# EAGLE board reaction_wheel_board_2017_12_11 (EAGLE 8.5.0)
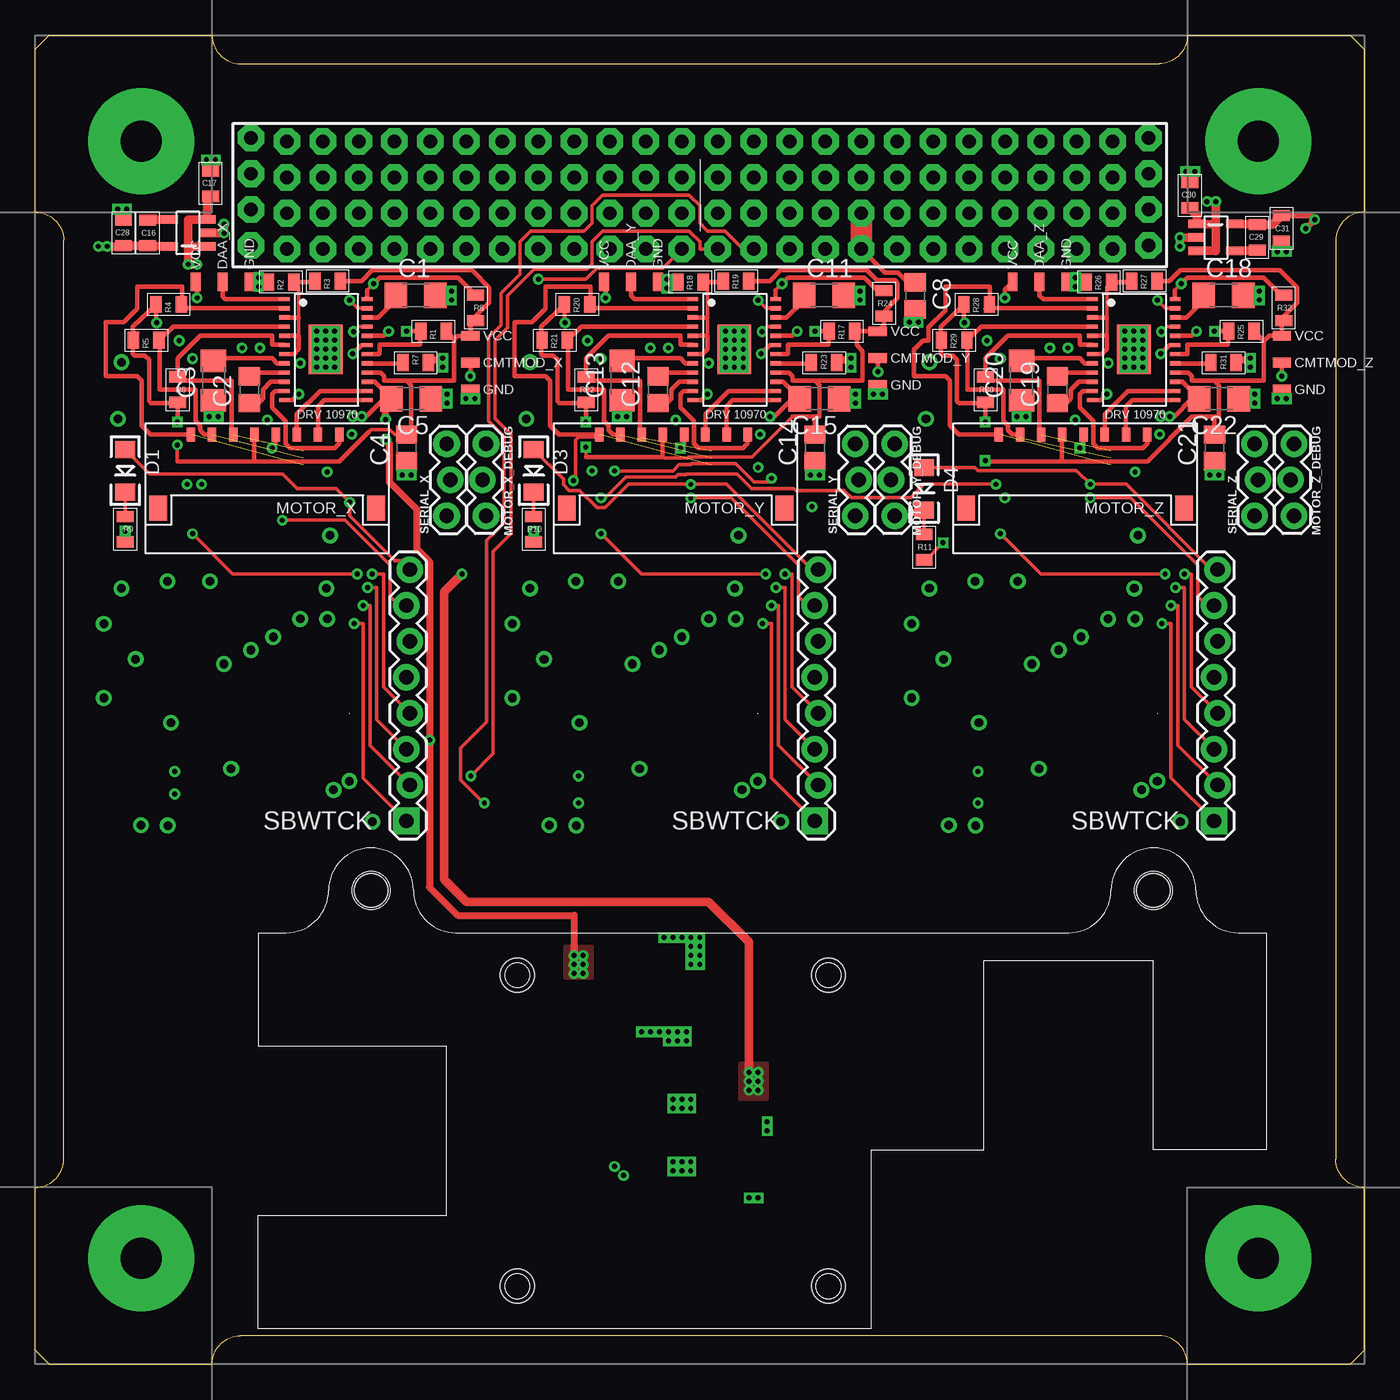
[diagram p2: board, top side]
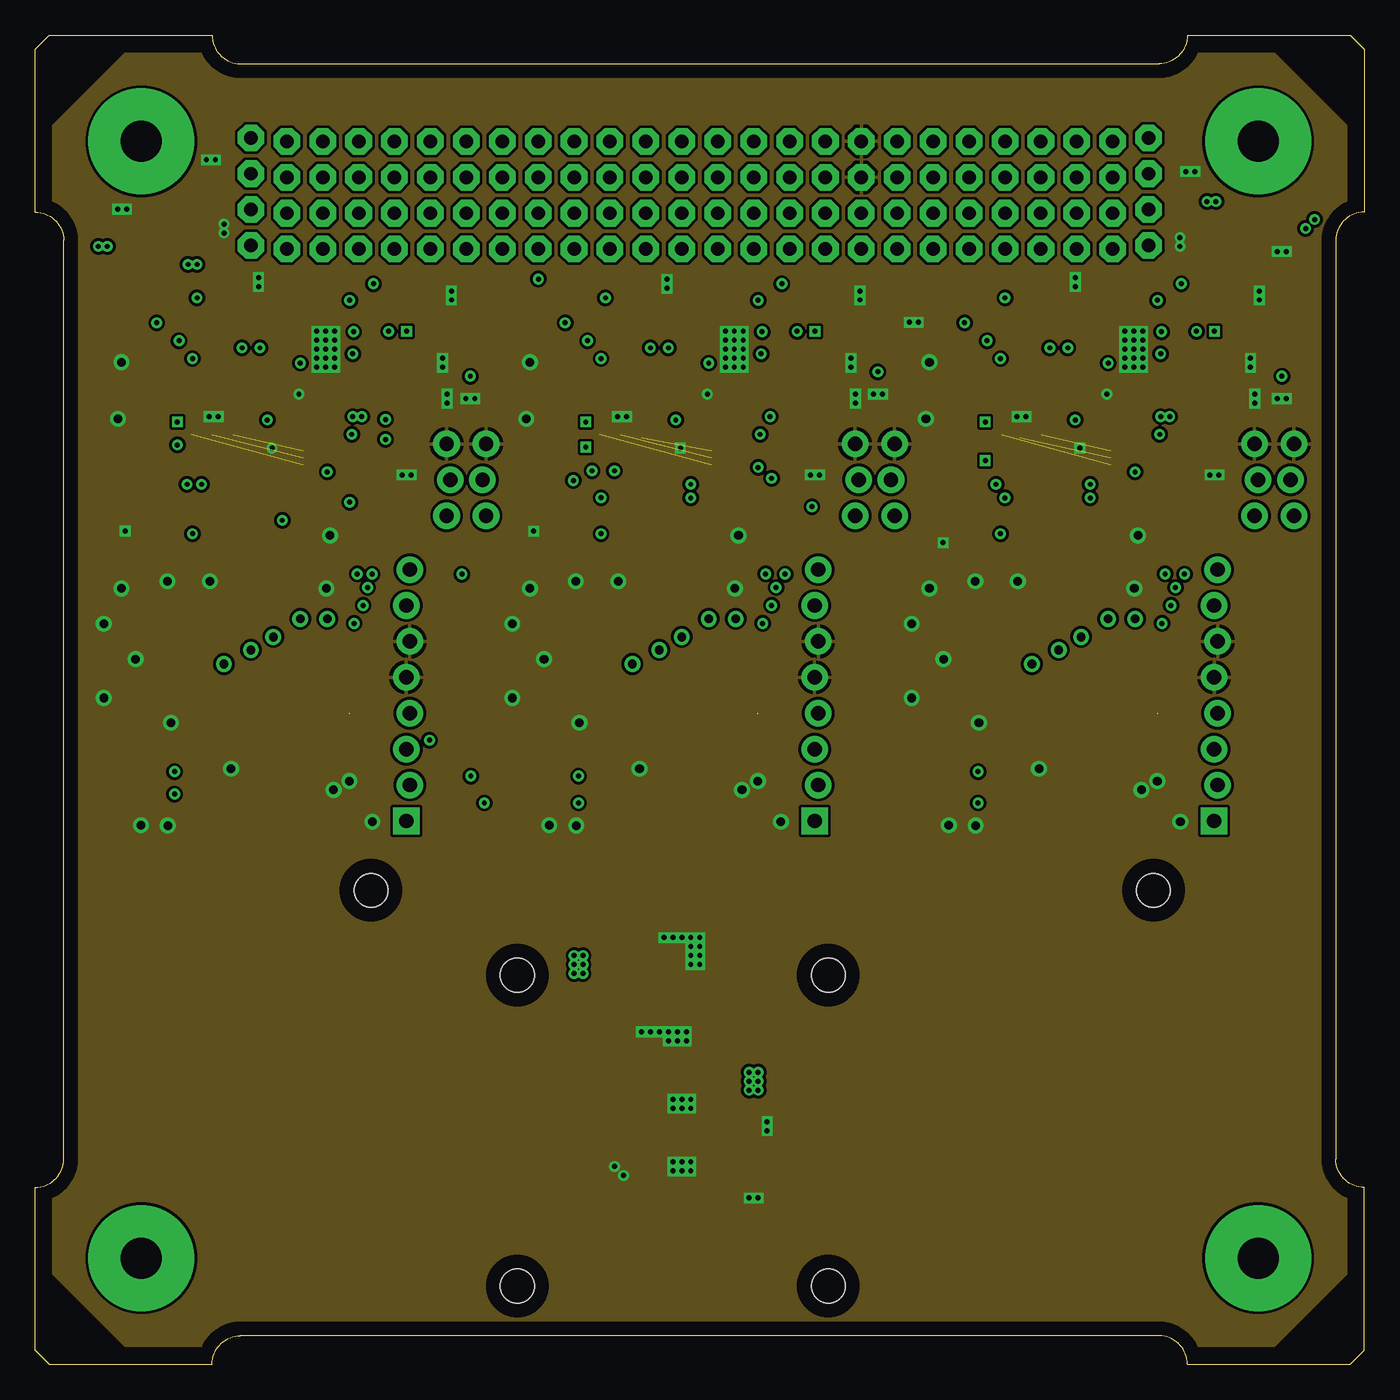
[diagram p3: board, inner layer Ground]
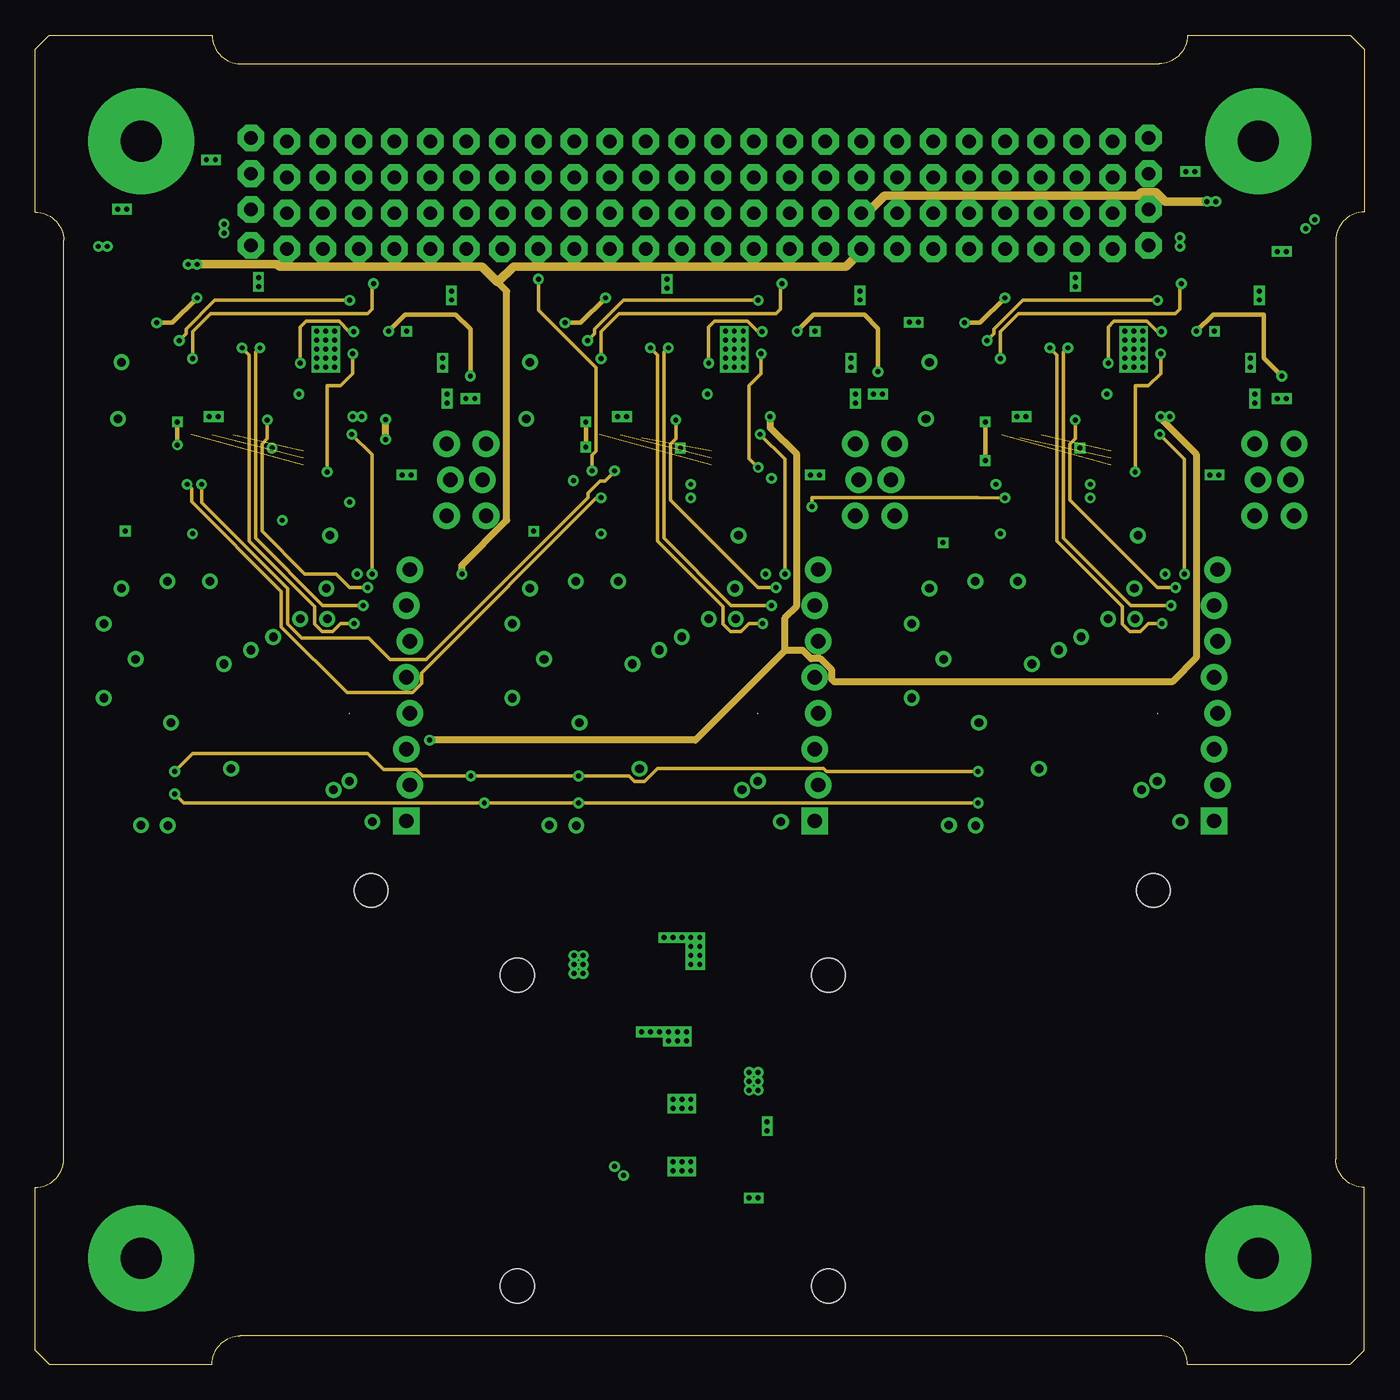
[diagram p4: board, inner layer Signal]
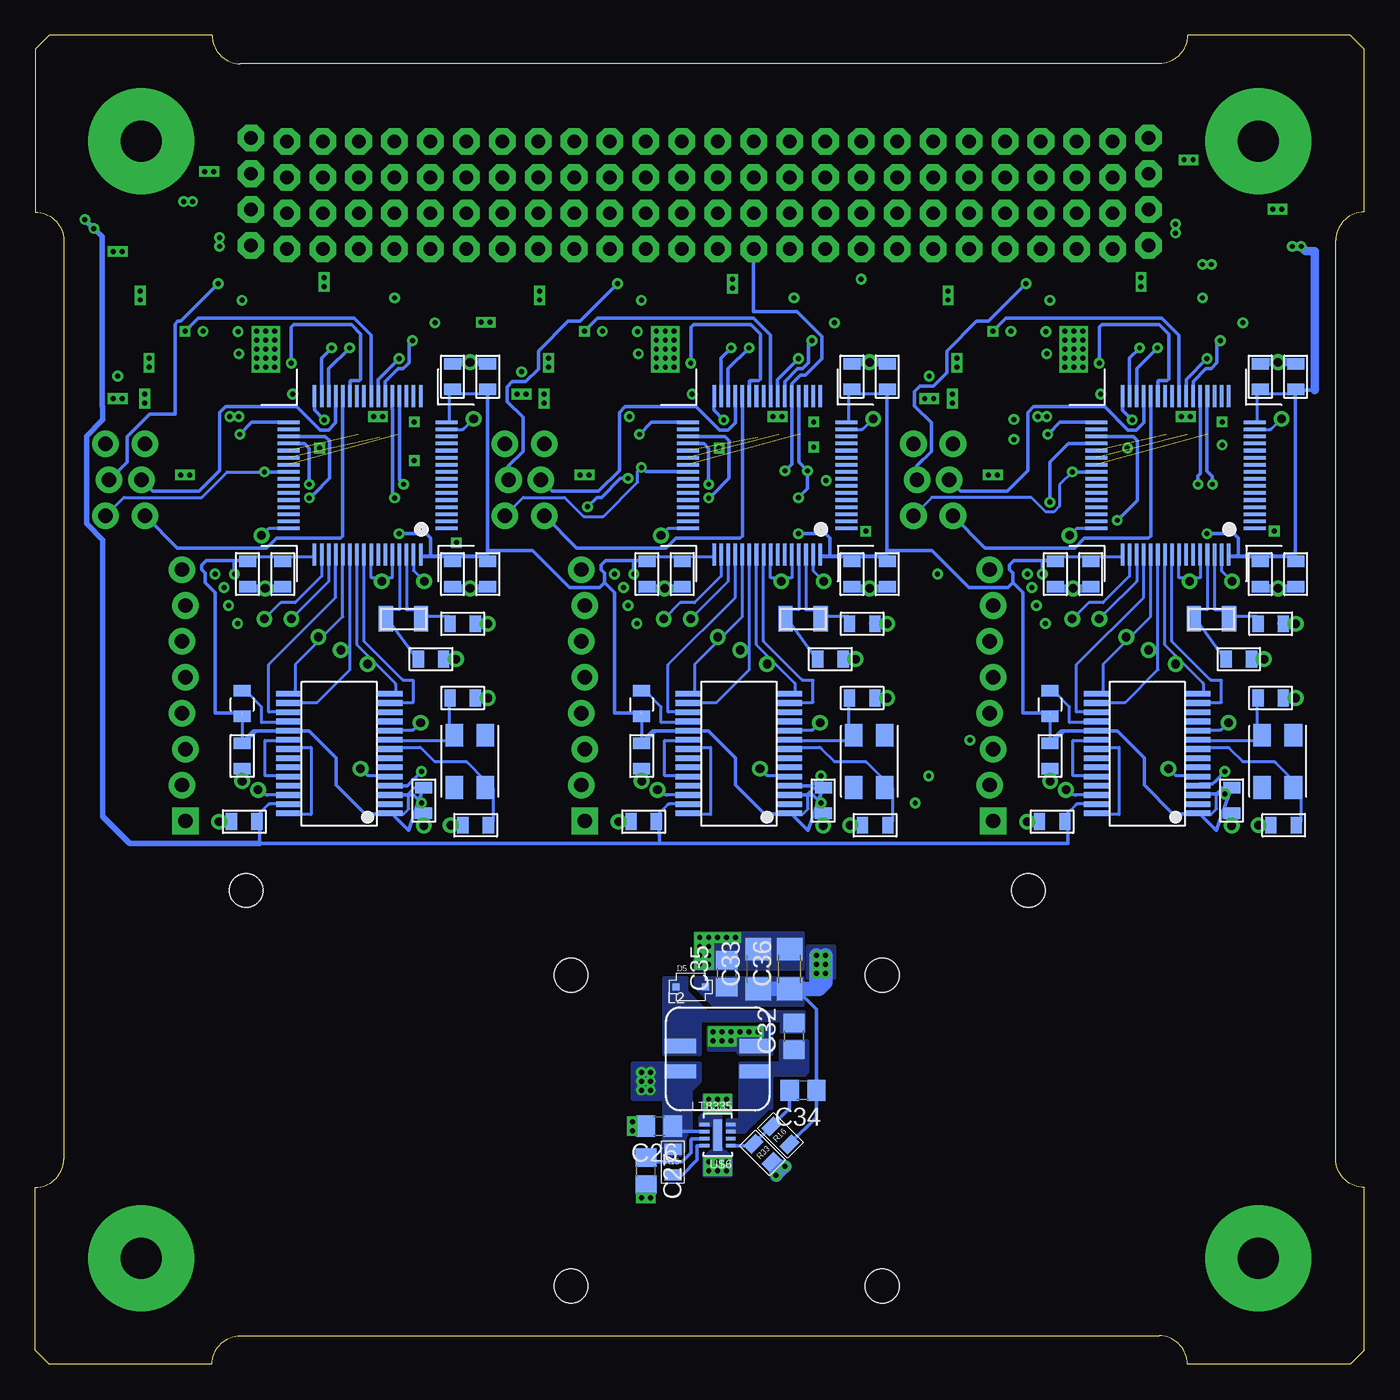
[diagram p5: board, bottom side, seen from below]

Size 94 x 94 mm. Coordinates in mm from the lower left corner, seen from the top.
Copper layers (1*2*3*16): Top 0.035mm / dielectric 1.5mm / Ground 0.035mm / dielectric 0.15mm / Signal 0.035mm / dielectric 0.2mm / Bottom 0.035mm
Design rules "default *": minimum track width 8mil, minimum drill 0.3mm, track to track 8mil, track to pad 8mil, pad to pad 8mil, via to via 8mil, smd to smd 0mil, copper to edge 40mil, drill to drill 8mil, minimum pad ring 10mil, minimum via ring 8mil, stop-mask expansion 4mil, vias tented up to drill 0mil, thermal gap 10mil
Net classes: 0 default: width 0.254 mm, drill 0.254 mm, clearance 0.152 mm

## Footprints (pad centres in the part's own frame; a part is rotated, then mirrored left to right if it is on the bottom)
C1206 = smd 1.6 x 1.8: 1 -1.4,0; 2 1.4,0
C0805 = smd 1.3 x 1.5: 1 -0.95,0; 2 0.95,0
0805 = smd 0.8 x 1.2: 1 -0.9,0; 2 0.9,0
0_OHM_JUMPER = smd 1.3 x 0.7: P$1 0,-1.9; P$2 0,0; P$3 0,1.9
LED-1206 = smd 1.2 x 1.4: A -1.5,0; C 1.5,0
SC-90 = smd 0.5 x 0.5: P$1 -1.05,0; P$2 1.05,0
WURTH_ELEKTRONIK_INDDD_744877001 = smd 1 x 2.2: P$1 -0.9,-2.65; P$2 -0.9,2.65; P$3 0.9,2.65; P$4 0.9,-2.65
PICOLOCK_8 = smd 1.25 x 1.8: MNT@1 -2.605,5.2; MNT@2 12.805,5.2 | smd 0.6 x 1: P$1 0,0; P$2 1.5,0; P$3 3,0; P$4 4.5,0; P$5 6,0; P$6 7.5,0; P$7 9,0; P$8 10.5,0
1X03_LOCK = drill 1.016 pad 1.88: 1 0,0.127; 2 2.54,-0.127; 3 5.08,0.127
1X08_CONNECTOR = drill 1.016 pad 1.88: 2 2.54,-0.127; 3 5.08,0.127; 4 7.62,-0.127; 5 10.16,0.127; 6 12.7,-0.127; 7 15.24,0.127; 8 17.78,-0.127 | drill 1.016 pad 1.88 square: SBWTCK 0,0.127
PC104_CONNECTOR = drill 0.953 pad 1.88 octagon: P$1 -31.75,32.134; P$2 -31.75,34.674; P$3 -31.75,37.214; P$4 -31.75,39.754; P$5 -29.21,31.88; P$6 -29.21,34.42; P$7 -29.21,36.96; P$8 -29.21,39.5; P$9 -26.67,31.88; P$10 -26.67,34.42; P$11 -26.67,36.96; P$12 -26.67,39.5; P$13 -24.13,31.88; P$14 -24.13,34.42; P$15 -24.13,36.96; P$16 -24.13,39.5; P$17 -21.59,31.88; P$18 -21.59,34.42; P$19 -21.59,36.96; P$20 -21.59,39.5; P$21 -19.05,31.88; P$22 -19.05,34.42; P$23 -19.05,36.96; P$24 -19.05,39.5; P$25 -16.51,31.88; P$26 -16.51,34.42; P$27 -16.51,36.96; P$28 -16.51,39.5; P$29 -13.97,31.88; P$30 -13.97,34.42; P$31 -13.97,36.96; P$32 -13.97,39.5; P$33 -11.43,31.88; P$34 -11.43,34.42; P$35 -11.43,36.96; P$36 -11.43,39.5; P$37 -8.89,31.88; P$38 -8.89,34.42; P$39 -8.89,36.96; P$40 -8.89,39.5; P$41 -6.35,31.88; P$42 -6.35,34.42; P$43 -6.35,36.96; P$44 -6.35,39.5; P$45 -3.81,31.88; P$46 -3.81,34.42; P$47 -3.81,36.96; P$48 -3.81,39.5; P$49 -1.27,31.88; P$50 -1.27,34.42; P$51 -1.27,36.96; P$52 -1.27,39.5; P$53 1.27,31.88; P$54 1.27,34.42; P$55 1.27,36.96; P$56 1.27,39.5; P$57 3.81,31.88; P$58 3.81,34.42; P$59 3.81,36.96; P$60 3.81,39.5; P$61 6.35,31.88; P$62 6.35,34.42; P$63 6.35,36.96; P$64 6.35,39.5; P$65 8.89,31.88; P$66 8.89,34.42; P$67 8.89,36.96; P$68 8.89,39.5; P$69 11.43,31.88; P$70 11.43,34.42; P$71 11.43,36.96; P$72 11.43,39.5; P$73 13.97,31.88; P$74 13.97,34.42; P$75 13.97,36.96; P$76 13.97,39.5; P$77 16.51,31.88; P$78 16.51,34.42; P$79 16.51,36.96; P$80 16.51,39.5; P$81 19.05,31.88; P$82 19.05,34.42; P$83 19.05,36.96; P$84 19.05,39.5; P$85 21.59,31.88; P$86 21.59,34.42; P$87 21.59,36.96; P$88 21.59,39.5; P$89 24.13,31.88; P$90 24.13,34.42; P$91 24.13,36.96; P$92 24.13,39.5; P$93 26.67,31.88; P$94 26.67,34.42; P$95 26.67,36.96; P$96 26.67,39.5; P$97 29.21,31.88; P$98 29.21,34.42; P$99 29.21,36.96; P$100 29.21,39.5; P$101 31.75,32.134; P$102 31.75,34.674; P$103 31.75,37.214; P$104 31.75,39.754
SOT-23-5 = smd 0.6 x 1.2: P$1 -0.95,-1.35; P$2 0,-1.35; P$3 0.95,-1.35; P$4 0.95,1.35; P$5 -0.95,1.35
BOARD_TEMPLATE_SECURED = drill 2.9 pad 7.5: P$1 -39.5,39.5; P$2 -39.5,-39.5; P$3 39.5,-39.5; P$4 39.5,39.5
MSP-CAN_BLOCK = smd 1.2 x 0.8: 1 -6,6.08; 2 -6,7.88; 3 -8.5,6.08; 4 -8.5,7.88; 9 -8.5,-6.08; 10 -8.5,-7.88; 11 -6,-6.08; 12 -6,-7.88; 13 8.5,6.08; 14 8.5,7.88; 15 6,6.08; 16 6,7.88; 23 8.875,18.955; 24 8.875,20.755; 25 8.875,17.045; 26 8.875,15.245; 27 -3.975,22.105; 28 -3.975,23.905 | smd 1 x 0.25: 3.3V@CAN1 -3.975,22.025; 3.3V@CAN2 8.875,18.875; 3.3V@MSP1 8.501,5.884; 3.3V@MSP2 -8.533,-5.962; 3.3V_ANALOG@MSP2 -8.482,5.904 | smd 0.8 x 1.2: 5 -5.83,10.5; 6 -7.63,10.5; 7 -3.58,13; 8 -5.38,13; 17 -8.545,24.75; 18 -6.745,24.75; 19 -5.83,15.75; 20 -7.63,15.75; 21 7.83,24.5; 22 9.63,24.5 | smd 0.25 x 1: 5V 7.65,24.5 | smd 1.75 x 0.4: CANH -1.6,21.96; CANL -1.6,22.61; P$65 -1.6,23.91; P$66 -1.6,23.26; P$69 -1.6,21.31; P$70 -1.6,20.66; P$71 -1.6,20.01; P$72 -1.6,19.36; P$73 -1.6,18.71; P$74 -1.6,18.06; P$75 -1.6,17.41; P$76 -1.6,16.76; P$77 -1.6,16.11; P$78 -1.6,15.46; P$79 5.6,15.46; P$80 5.6,16.11; P$81 5.6,16.76; P$82 5.6,17.41; P$83 5.6,18.06; P$84 5.6,18.71; P$85 5.6,19.36; P$86 5.6,20.01; P$87 5.6,20.66; P$88 5.6,21.31; P$89 5.6,21.96; P$90 5.6,22.61; P$91 5.6,23.26; P$92 5.6,23.91 | drill 0.61: GND@1 -3.975,24.775; GND@2 -5.875,24.75; GND@3 -3.75,17.5; GND@4 0.5,20.75; GND@5 -8.5,15.75; GND@7 -8.5,10.5; GND@8 -7.25,8; GND@9 -4,7.5; GND@10 -1,7.5; GND@11 7.75,22.25; GND@12 10.5,24.5; GND@13 8.875,21.625; GND@14 7.25,8; GND@15 7.5,4.25; GND@16 -7.5,-4; GND@17 -7.25,-8; GND@26 -6.25,13; P2.4_SPI-CS2 5.397,10.16; P2.7_SPI-CS3 7.303,10.16; P5.4_SPI-MOSI 3.487,11.434; P5.5_SPI-MISO 1.9,12.354; P5.6_SPI-CLK 0,13.348 | smd 1.55 x 0.25: P1.0_A0 -5.6,3.75; P1.1_A1 -5.6,3.25; P1.2_A2 -5.6,2.75; P1.3_A3 -5.6,-1.75; P1.4_A4 -5.6,-2.25; P1.5_A5 -5.6,-2.75; P1.6_GPIO/PWM 5.6,-0.75; P1.7_GPIO/PWM 5.6,-0.25; P2.1_RXD 5.6,-3.75; P2.2_GPIO/PWM 5.6,-3.25; P3.0_A12 -5.6,2.25; P3.1_A13 -5.6,1.75; P3.2_A14 -5.6,1.25; P3.3_A15 -5.6,0.75; P3.4_GPIO_DEBUG 5.6,-2.75; P3.5_GPIO_DEBUG 5.6,-2.25; P3.6_GPIO/PWM 5.6,-1.75; P3.7_GPIO/PWM 5.6,-1.25; P5.0_I2C-SDA-1 5.6,0.25; P5.1_I2C-SCL-1 5.6,0.75; P7.0_I2C-SDA-2 -5.6,-0.25; P7.1_I2C-SCL-2 -5.6,-0.75; P$8 -5.6,0.25; P$11 -5.6,-1.25; P$15 -5.6,-3.25; P$16 -5.6,-3.75; P$43 5.6,1.25; P$44 5.6,1.75; P$45 5.6,2.25; P$46 5.6,2.75; P$47 5.6,3.25; P$48 5.6,3.75 | smd 0.25 x 1.55: P2.0_TXD 3.75,-5.6; P2.5_GPIO 1.75,-5.6; P2.6_GPIO/PWM 2.25,-5.6; P4.0_GPIO -0.25,-5.6; P4.1_GPIO 0.25,-5.6; P4.2_GPIO 0.75,-5.6; P4.3_GPIO 1.25,-5.6; P7.2_SYNC1 -1.75,-5.6; P7.3_GPIO -1.25,-5.6; P7.4_GPIO -0.75,-5.6; P$17 -3.75,-5.6; P$18 -3.25,-5.6; P$19 -2.75,-5.6; P$49 3.75,5.6; P$50 3.25,5.6; P$51 2.75,5.6; P$52 2.25,5.6; P$53 1.75,5.6; P$54 1.25,5.6; P$55 0.75,5.6; P$56 0.25,5.6; P$57 -0.25,5.6; P$58 -0.75,5.6; P$59 -1.25,5.6; P$60 -1.75,5.6; P$61 -2.25,5.6; P$62 -2.75,5.6; P$63 -3.25,5.6; P$64 -3.75,5.6; PJ.3_SYNC2 -2.25,-5.6; SBWTCK 2.75,-5.6; SBWTDIO 3.25,-5.6 | smd 1 x 1.8: P$93 -3.79,10.16; P$94 -1.29,10.16 | smd 1.25 x 1.6: P$104 -6.13,18.38; P$105 -6.13,22.08; P$106 -8.33,22.08; P$107 -8.33,18.38
DDB = smd 0.61 x 2.2: GND 0,0 | smd 0.7 x 0.25: P$1 -0.925,0.75; P$2 -0.925,0.25; P$3 -0.925,-0.25; P$4 -0.925,-0.75; P$5 0.925,-0.75; P$6 0.925,-0.25; P$7 0.925,0.25; P$8 0.925,0.75
DRV10970 = smd 0.3 x 0.75: BRKMOD -1.6,2.925; CMTMOD -0.95,2.925; CPN 2.3,-2.925; CPP 1.65,-2.925; CS 1,2.925; DAA -3.55,-2.925; FG -3.55,2.925; FR -2.9,2.925; GND@1 3.6,-2.925; PWM -0.3,2.925; RD 0.35,2.925; RETRY -2.25,2.925; U 2.95,2.925; U_HN -2.25,-2.925; U_HP -2.9,-2.925; V 3.6,2.925; V_HN -0.95,-2.925; V_HP -1.6,-2.925; VCP 1,-2.925; VINT 1.65,2.925; VM 2.3,2.925; W 2.95,-2.925; W_HN 0.35,-2.925; W_HP -0.3,-2.925 | smd 3.5 x 2.4: GND@2 0,0
REACTION_WHEEL_BRACKET = hole 2.39: -11,11; 11,11; 11,-11; -11,-11; 21.35,-17; -34,-17

## Placement (x,y rotation side)
C1  2.2uF  [C1206]  26.9,75.6 0 top
C2  0.1uF  [C0805]  15.15,68.93 90 top
C3  1uF  [C1206]  12.61,69.57 90 top
C4  0.1uF  [C0805]  26.26,64.81 90 top
C5  1uF  [C1206]  26.58,68.3 180 top
C8  10 uF  [C0805]  62.24,75.58 270 top
C11  2.2uF  [C1206]  55.79,75.6 0 top
C12  0.1uF  [C0805]  44.04,68.93 90 top
C13  1uF  [C1206]  41.5,69.57 90 top
C14  0.1uF  [C0805]  55.16,64.81 90 top
C15  1uF  [C1206]  55.47,68.3 180 top
C16  0.01 μF  [0805]  7.95,80.02 90 top
C17  1 μF  [0805]  12.39,83.51 270 top
C18  2.2uF  [C1206]  84.05,75.6 0 top
C19  0.1uF  [C0805]  72.3,68.93 90 top
C20  1uF  [C1206]  69.76,69.57 90 top
C21  0.1uF  [C0805]  83.41,64.81 90 top
C22  1uF  [C1206]  83.73,68.3 180 top
C26  2.2 μF  [C0805]  49.86,16.84 180 bottom
C27  2.2 μF  [C0805]  50.81,13.66 270 bottom
C28  1 μF  [0805]  6.23,80.02 270 top
C29  0.01 μF  [0805]  86.43,79.7 270 top
C30  1 μF  [0805]  81.67,82.69 270 top
C31  1μF  [0805]  88.15,80.34 90 top
C32  1 μF  [C0805]  40.33,23.19 90 bottom
C33  22 μF  [C1206]  42.87,27.95 90 bottom
C34  5.6 pF  [C0805]  39.7,19.38 180 bottom
C35  10 μF  [C0805]  45.09,27.63 90 bottom
C36  47 μF  [C1206]  40.65,27.95 90 bottom
CMTMOD_X  0_OHM_JUMPER  [0_OHM_JUMPER]  30.77,70.84 0 top
CMTMOD_Y  0_OHM_JUMPER  [0_OHM_JUMPER]  59.6,71.16 0 top
CMTMOD_Z  0_OHM_JUMPER  [0_OHM_JUMPER]  88.18,70.84 0 top
D1  [LED-1206]  6.36,63.19 270 top
D3  [LED-1206]  35.25,63.19 270 top
D4  [LED-1206]  62.88,61.92 270 top
D5  PMEG6010CEJ  [SC-90]  47.63,26.68 0 bottom
DAA_X  0_OHM_JUMPER  [0_OHM_JUMPER]  13.25,76.55 90 top
DAA_Y  0_OHM_JUMPER  [0_OHM_JUMPER]  42.14,76.55 90 top
DAA_Z  0_OHM_JUMPER  [0_OHM_JUMPER]  71.03,76.55 90 top
L2  WURTH_ELEKTRONIK_INDDD_744877001  [WURTH_ELEKTRONIK_INDDD_744877001]  45.73,21.6 270 bottom
MOTOR_X  PICOLOCK_8  [PICOLOCK_8]  21.5,65.76 180 top
MOTOR_X_DEBUG  [1X03_LOCK]  31.76,65.1 270 top
MOTOR_Y  PICOLOCK_8  [PICOLOCK_8]  50.39,65.76 180 top
MOTOR_Y_DEBUG  [1X03_LOCK]  60.65,65.1 270 top
MOTOR_Z  PICOLOCK_8  [PICOLOCK_8]  78.65,65.76 180 top
MOTOR_Z_DEBUG  [1X03_LOCK]  88.91,65.1 270 top
MSP_X_DEBUG  PROGRAM/DEBUG_PORT  [1X08_CONNECTOR]  26.36,38.43 90 top
MSP_Y_DEBUG  PROGRAM/DEBUG_PORT  [1X08_CONNECTOR]  55.26,38.43 90 top
MSP_Z_DEBUG  PROGRAM/DEBUG_PORT  [1X08_CONNECTOR]  83.51,38.43 90 top
PC104  PC104_CONNECTOR  [PC104_CONNECTOR]  47,47 0 top
R1  3.3K  [0805]  28.17,73.06 0 top
R2  3.3K  [0805]  17.38,76.56 0 top
R3  3.3K  [0805]  20.67,76.63 0 top
R4  10K  [0805]  9.44,74.97 0 top
R5  10K  [0805]  7.85,72.43 0 top
R6  10K  [0805]  10.07,68.93 90 top
R7  [0805]  26.9,70.84 180 top
R8  3.3K  [0805]  31.15,74.72 90 top
R9  [0805]  6.36,59.06 90 top
R10  [0805]  35.25,59.06 90 top
R11  [0805]  62.88,57.8 90 top
R15  1 kΩ  [0805]  48.91,14.3 270 bottom
R16  330 kΩ  [0805]  41.29,16.2 315 bottom
R17  3.3K  [0805]  57.06,73.06 0 top
R18  3.3K  [0805]  46.34,76.56 0 top
R19  3.3K  [0805]  49.57,76.63 0 top
R20  10K  [0805]  38.33,74.97 0 top
R21  10K  [0805]  36.74,72.43 0 top
R22  10K  [0805]  38.96,68.93 90 top
R23  [0805]  55.79,70.84 180 top
R24  3.3K  [0805]  60.04,75.04 90 top
R25  3.3K  [0805]  85.32,73.06 0 top
R26  3.3K  [0805]  75.23,76.56 0 top
R27  3.3K  [0805]  78.46,76.63 0 top
R28  10K  [0805]  66.59,74.97 0 top
R29  10K  [0805]  65,72.43 0 top
R30  10K  [0805]  67.22,68.93 90 top
R31  [0805]  84.05,70.84 180 top
R32  3.3K  [0805]  88.3,74.72 90 top
R33  120 kΩ  [0805]  42.55,14.93 135 bottom
SERIAL_X  [1X03_LOCK]  29.22,60.02 90 top
SERIAL_Y  [1X03_LOCK]  58.11,60.02 90 top
SERIAL_Z  [1X03_LOCK]  86.37,60.02 90 top
U2  TPS732XX  [SOT-23-5]  10.81,80.02 90 top
U3  TPS732XX  [SOT-23-5]  83.51,79.7 270 top
U$1  BOARD_TEMPLATESERCURED  [BOARD_TEMPLATE_SECURED]  47,47 0 top
U$3  MSP-CAN_BLOCK  [MSP-CAN_BLOCK]  13.35,62.88 180 bottom
U$6  LT8335  [DDB]  45.73,16.2 180 bottom
U$7  DRV10970  [DRV10970]  20.55,71.79 270 top
U$9  REACTION_WHEEL_BRACKET  [REACTION_WHEEL_BRACKET]  45.09,16.52 180 top
U$10  MSP-CAN_BLOCK  [MSP-CAN_BLOCK]  42.24,62.88 180 bottom
U$12  DRV10970  [DRV10970]  49.44,71.79 270 top
U$13  MSP-CAN_BLOCK  [MSP-CAN_BLOCK]  70.5,62.88 180 bottom
U$15  DRV10970  [DRV10970]  77.7,71.79 270 top

## Tracks (layer width: path | path; a pad name or v marks a point on that pad's centre or on a via)
+3V3  (via drill 0.35)  (3 unrouted)
  Top 0.254: v11.12,58.75 13.98,55.9 v22.77,55.9 | v40.02,58.75 42.87,55.9 v51.66,55.9 | v68.27,58.75 71.12,55.9 v79.92,55.9
  Top 0.61: U2.P$5 8,79.07 C16.1 C28.2 6.18,79.07 v4.46,79.07
  Bottom 0.254: 3.5,68.91 4.74,68.91 U$3.3.3V@MSP2 4.86,68.79 U$3.3.3V_ANALOG@MSP2 5.05,57.16 8.9,57.16 | U$3.3.3V@CAN1 10.45,37.75 11.44,38.75 11.44,38.81 11.57,38.94 13.54,38.94 15.57,40.97 15.57,42.87 17.47,44.78 21.44,44.78 U$3.3.3V@CAN2 | U$3.3.3V@MSP1 21.99,56.84 22.78,56.84 | 22.78,56.84 24.78,56.84 25.09,56.52 25.09,56.21 24.85,55.96 24.85,55.28 | 24.85,55.28 24.14,54.57 24.14,46.05 22.23,46.05 | 9.54,57.16 8.9,57.16 | 8.9,57.16 8.9,58.43 9.22,58.75 v11.12,58.75 | v22.77,55.9 v22.78,55.9 22.78,56.84 | 33.76,57.56 U$10.3.3V_ANALOG@MSP2 33.94,57.16 37.79,57.16 | 33.63,68.91 U$10.3.3V@MSP2 33.76,68.79 33.76,57.56 | U$10.3.3V@CAN1 39.34,37.75 40.33,38.75 40.33,38.81 40.46,38.94 42.43,38.94 44.46,40.97 44.46,42.87 46.37,44.78 50.34,44.78 U$10.3.3V@CAN2 | U$10.3.3V@MSP1 50.89,56.84 51.67,56.84 | 51.67,56.84 53.67,56.84 53.98,56.52 53.98,56.21 53.74,55.96 53.74,55.28 | 53.74,55.28 53.03,54.57 53.03,46.05 51.13,46.05 | 38.43,57.16 37.79,57.16 | 37.79,57.16 37.79,58.43 38.11,58.75 v40.02,58.75 | v51.66,55.9 v51.67,55.9 51.67,56.84 | 62.01,57.56 U$13.3.3V_ANALOG@MSP2 62.2,57.16 66.05,57.16 | 61.89,68.91 U$13.3.3V@MSP2 62.01,68.79 62.01,57.56 | U$13.3.3V@CAN1 67.59,37.75 68.59,38.75 68.59,38.81 68.72,38.94 70.69,38.94 72.72,40.97 72.72,42.87 74.62,44.78 78.59,44.78 U$13.3.3V@CAN2 | U$13.3.3V@MSP1 79.14,56.84 79.92,56.84 | 79.92,56.84 81.92,56.84 82.24,56.52 82.24,56.21 82,55.96 82,55.28 81.29,54.57 81.29,46.05 79.39,46.05 | 66.69,57.16 66.05,57.16 | 66.05,57.16 66.05,58.43 66.37,58.75 v68.27,58.75 | v79.92,55.9 79.92,56.84 | 24.85,55.28 25.19,54.94 27.95,54.94 30.57,57.56 33.76,57.56
  Bottom 0.254: 53.74,55.28 54.08,54.94 56.21,54.94 58.83,57.56 62.01,57.56
  Bottom 0.61: 3.5,68.91 3.5,78.75 4.14,78.75 v4.46,79.07 v5.09,79.07
+5V  (via drill 0.35)
  Top 0.406: C31.2 90.23,81.24 v90.5,80.97 v89.86,80.34
  Top 0.61: U3.P$5 86.38,80.65 C29.1 87.51,80.6 C31.2
  Bottom 0.254: U$3.5V 20.96,38.34 20.96,36.84 49.86,36.84 | 49.86,36.84 49.86,37.45 49.89,37.48 U$10.5V | 49.86,36.84 78.11,36.84 78.11,37.45 78.14,37.48 U$13.5V
  Bottom 0.406: 78.11,36.84 87.32,36.84 89.23,38.75 89.23,58.3 90.38,59.46 90.38,65.66 89.23,66.81 89.23,67.7 89.28,67.75 89.28,79.75 v90.5,80.97
BRKMOD_X  (via drill 0.35)
  Top 0.254: U$7.BRKMOD 22.87,73.39 v22.52,73.03
  Signal 0.254: v22.52,73.03 22.21,73.03 21.48,73.77 19.16,73.77 18.74,73.35 v18.74,70.81
  Bottom 0.254: U$3.P4.3_GPIO 14.6,69.54 14.56,69.58 13.94,69.58 13.83,69.7 13.83,72.87 14.49,73.53 18.57,73.53 18.74,73.35 v18.74,70.81
BRKMOD_Y  (via drill 0.35)
  Top 0.254: U$12.BRKMOD 51.77,73.39 v51.41,73.03
  Signal 0.254: v51.41,73.03 51.11,73.03 50.37,73.77 48.05,73.77 47.63,73.35 v47.63,70.81
  Bottom 0.254: U$10.P4.3_GPIO 43.49,69.54 43.45,69.58 42.84,69.58 42.72,69.7 42.72,72.87 43.38,73.53 47.46,73.53 47.63,73.35 v47.63,70.81
BRKMOD_Z  (via drill 0.35)
  Top 0.254: U$15.BRKMOD 80.02,73.39 v79.67,73.03
  Signal 0.254: v79.67,73.03 79.36,73.03 78.63,73.77 76.31,73.77 75.89,73.35 v75.89,70.81
  Bottom 0.254: U$13.P4.3_GPIO 71.75,69.54 71.71,69.58 71.09,69.58 70.98,69.7 70.98,72.87 71.64,73.53 75.72,73.53 75.89,73.35 v75.89,70.81
CANH  (via drill 0.35)
  Top 0.254: PC104.P$53 47,78.88 47,79.41 46.26,80.15 40.12,80.15 39.38,79.41 39.38,77.81 39.03,77.46 35.29,77.46 33.4,75.57 33.4,73.32 32.53,72.45 32.53,66.89 33.66,65.76 33.66,58.75 32.39,57.48 32.39,43.19 v30.81,41.6
  Signal 0.254: v9.85,41.92 11.12,43.19 23.51,43.19 24.64,42.06 26.94,42.06 27.4,41.6 v30.81,41.6 v38.43,41.6 42,41.6 42.37,41.24 43.11,41.24 44.01,42.14 55.76,42.14 55.97,41.92 v66.69,41.92
  Bottom 0.254: U$3.CANH 11.63,41.04 10.73,41.04 10.54,41.23 v9.85,41.92 | v38.43,41.6 39.12,40.91 U$10.CANH | v66.69,41.92 67.69,40.91 U$13.CANH
CANL  (via drill 0.35)
  Top 0.254: PC104.P$57 50.07,78.88 48.8,80.15 47.55,80.15 47,80.7 47,81.95 46.26,82.69 40.12,82.69 39.38,81.95 39.38,80.7 38.83,80.15 35.04,80.15 34.3,79.41 34.3,77.12 32.94,75.76 32.94,73.51 32.08,72.64 32.08,66.7 33.16,65.62 33.16,59.49 31.94,58.27 31.94,45.41 30.1,43.57 30.1,41.31 31.71,39.7 v31.76,39.7
  Signal 0.254: v9.85,40.33 10.49,39.7 v31.76,39.7 v38.43,39.7 v66.69,39.7
  Bottom 0.254: U$3.CANL 11.68,40.33 v9.85,40.33 | v38.43,39.7 39,40.27 U$10.CANL | v66.69,39.7 67.25,40.27 U$13.CANL
CMTMOD_X  (via drill 0.35)
  Top 0.305: U$7.CMTMOD 24.67,72.74 v24.99,73.06 | v30.77,69.89 CMTMOD_X.P$2
  Signal 0.305: v24.99,73.06 26.16,74.23 29.74,74.23 30.77,73.2 v30.77,69.89
CMTMOD_Y  (via drill 0.35)
  Top 0.305: U$12.CMTMOD 53.57,72.74 v53.89,73.06 | v59.6,70.2 CMTMOD_Y.P$2
  Signal 0.305: v53.89,73.06 55.06,74.23 58.63,74.23 59.6,73.27 v59.6,70.2
CMTMOD_Z  (via drill 0.35)
  Top 0.305: U$15.CMTMOD 81.82,72.74 v82.14,73.06 | v88.18,69.89 CMTMOD_Z.P$2
  Signal 0.305: v82.14,73.06 83.31,74.23 86.89,74.23 86.89,71.17 v88.18,69.89
CPN_X
  Top 0.305: U$7.CPN 16.66,69.49 16.1,68.94 16.1,68.3 15.79,67.98 C2.1
CPN_Y
  Top 0.305: U$12.CPN 45.55,69.49 45,68.94 45,68.3 44.68,67.98 C12.1
CPN_Z
  Top 0.305: U$15.CPN 73.81,69.49 73.25,68.94 73.25,68.3 72.94,67.98 C19.1
CPP_X
  Top 0.305: U$7.CPP 15.09,70.14 C2.2
CPP_Y
  Top 0.305: U$12.CPP 43.98,70.14 C12.2
CPP_Z
  Top 0.305: U$15.CPP 72.24,70.14 C19.2
CS_X
  Top 0.305: U$7.CS 25.58,70.79 R7.2
CS_Y
  Top 0.305: U$12.CS 54.48,70.79 R23.2
CS_Z
  Top 0.305: U$15.CS 82.73,70.79 R31.2
DAA_X
  Top 0.305: 13.35,76.45 DAA_X.P$2 13.25,75.53 13.43,75.34 U$7.DAA
DAA_Y
  Top 0.305: U$12.DAA 42.4,75.34 42.14,75.6 DAA_Y.P$2
DAA_Z
  Top 0.305: U$15.DAA 71.29,75.34 71.03,75.6 DAA_Z.P$2
EN_UVLO
  Bottom 0.254: U$6.P$8 47.18,15.45 47.18,14.44 48.22,13.4 R15.2
FBX
  Bottom 0.254: U$6.P$1 43.31,15.45 R33.2 R16.1 40.65,18.11 C34.2
FG_X  (via drill 0.35)
  Top 0.254: 23.47,75.99 v23.92,76.43
  Top 0.305: U$7.FG 23.47,75.99 | v23.92,76.43 24.36,76.87 29.9,76.87 R8.2
  Signal 0.254: v23.92,76.43 23.82,76.34 23.82,74.62 23.51,74.31 12.39,74.31 11.12,73.03 v11.12,71.13
  Bottom 0.254: v11.12,71.13 12.6,69.66 U$3.P7.4_GPIO | v23.92,76.43 26.58,73.77 27.41,73.77 29.51,71.67 29.51,70.14 30.48,69.18 31.43,69.18 31.8,68.81 31.8,67.78 30.62,66.6 30.62,64.57 31.63,63.55 MOTOR_X_DEBUG.2
FG_Y  (via drill 0.35)
  Top 0.254: 52.37,75.99 v52.81,76.43
  Top 0.305: U$12.FG 52.37,75.99 | v52.81,76.43 53.25,76.87 53.89,76.87 53.9,76.86 58.65,76.86 59.57,75.94 R24.2
  Signal 0.254: v52.81,76.43 52.72,76.34 52.72,74.62 52.4,74.31 41.29,74.31 40.02,73.03 v40.02,71.13
  Bottom 0.254: v40.02,71.13 41.49,69.66 U$10.P7.4_GPIO | v52.81,76.43 55.47,73.77 56.31,73.77 58.4,71.67 58.4,70.4 59.31,69.5 60.26,69.5 60.63,69.13 60.63,68.1 59.51,66.98 59.51,64.57 60.52,63.55 MOTOR_Y_DEBUG.2
FG_Z  (via drill 0.35)
  Top 0.254: 80.62,75.99 v81.07,76.43
  Top 0.305: U$15.FG 80.62,75.99 | v81.07,76.43 81.51,76.87 82.15,76.87 82.16,76.86 86.91,76.86 88.14,75.62 R32.2
  Signal 0.254: v81.07,76.43 80.97,76.34 80.97,74.62 80.66,74.31 69.54,74.31 68.27,73.03 v68.27,71.13
  Bottom 0.254: v68.27,71.13 69.75,69.66 U$13.P7.4_GPIO | MOTOR_Z_DEBUG.2 87.51,63.83 87.51,65.62 85.92,67.22 84.12,67.22 84.12,73.58 83.93,73.77 83.73,73.77 v81.07,76.43
FR_X  (via drill 0.35)
  Top 0.254: U$7.FR 22.8,74.69 v22.23,75.26
  Signal 0.254: v10.17,72.4 10.67,72.89 10.67,73.22 12.7,75.26 v22.23,75.26
  Bottom 0.254: U$3.P7.3_GPIO 12.1,69.51 11.18,70.42 10.83,70.42 10.41,70.84 10.41,72.16 v10.17,72.4
FR_Y  (via drill 0.35)
  Top 0.254: U$12.FR 51.69,74.69 v51.13,75.26
  Signal 0.254: v39.06,72.4 39.56,72.89 39.56,73.22 41.59,75.26 v51.13,75.26
  Bottom 0.254: U$10.P7.3_GPIO 40.99,69.51 40.08,70.42 39.72,70.42 39.31,70.84 39.31,72.16 v39.06,72.4
FR_Z  (via drill 0.35)
  Top 0.254: U$15.FR 79.95,74.69 v79.39,75.26
  Signal 0.254: v67.32,72.4 67.81,72.89 67.81,73.22 69.85,75.26 v79.39,75.26
  Bottom 0.254: U$13.P7.3_GPIO 69.25,69.51 68.33,70.42 67.98,70.42 67.56,70.84 67.56,72.16 v67.32,72.4
GND  (via drill 0.35)
  Top 0.254: v30.45,68.3 30.45,68.62 CMTMOD_X.P$1 31.09,68.62 v31.09,68.3 | v25.95,62.9 25.95,63.54 C4.1 | C4.1 | v26.58,62.9 26.58,63.54 C4.1 | v12.29,67.03 12.29,67.85 C3.1 12.93,67.85 v12.93,67.03 | v15.79,76.24 15.46,76.24 DAA_X.P$1 15.46,76.87 v15.79,76.87 | v29.44,75.92 28.62,75.92 C1.2 28.62,75.28 v29.44,75.28 | v28.8,71.16 28.17,71.16 R7.1 arc-90 v28.8,70.52 | v29.12,68.62 28.3,68.62 28.07,68.39 | 28.07,68.39 C5.1 | v29.12,67.98 28.49,67.98 28.07,68.39 | v20.55,71.16 v21.18,70.52 | v20.55,71.16 v20.55,70.52 U$7.GND@2 | v20.55,71.16 v19.91,70.52 | U$7.GND@2 v19.91,71.16 | U$7.GND@2 v20.55,71.16 | U$7.GND@2 v21.18,71.16 | U$7.GND@2 v21.18,71.79 | U$7.GND@2 v19.91,71.79 | U$7.GND@2 v19.91,72.43 | U$7.GND@2 v21.18,72.43 | v20.55,72.43 v21.18,73.06 | U$7.GND@2 v20.55,73.06 | U$7.GND@2 v20.55,72.43 | v20.55,72.43 v19.91,73.06 | v59.28,68.62 59.28,68.94 CMTMOD_Y.P$1 59.92,68.94 v59.92,68.62 | v54.84,62.9 54.84,63.54 C14.1 | C14.1 | v55.47,62.9 55.47,63.54 C14.1 | v41.19,67.03 41.19,67.85 C13.1 41.82,67.85 v41.82,67.03 | v44.68,76.11 44.36,76.24 DAA_Y.P$1 44.36,76.87 v44.68,76.75 | v58.33,75.92 57.51,75.92 C11.2 57.51,75.28 v58.33,75.28 | v57.7,71.16 57.06,71.16 R23.1 arc-90 v57.7,70.52 | v58.01,68.62 57.19,68.62 56.97,68.39 | 56.97,68.39 C15.1 | v58.01,67.98 57.38,67.98 56.97,68.39 | v49.44,71.16 v50.08,70.52 | v49.44,71.16 v49.44,70.52 U$12.GND@2 | v49.44,71.16 v48.81,70.52 | U$12.GND@2 v48.81,71.16 | U$12.GND@2 v49.44,71.16 | U$12.GND@2 v50.08,71.16 | U$12.GND@2 v50.08,71.79 | U$12.GND@2 v48.81,71.79 | U$12.GND@2 v48.81,72.43 | U$12.GND@2 v50.08,72.43 | v49.44,72.43 v50.08,73.06 | U$12.GND@2 v49.44,73.06 | U$12.GND@2 v49.44,72.43
  Top 0.254: v49.44,72.43 v48.81,73.06 | v87.86,68.3 87.86,68.62 CMTMOD_Z.P$1 88.49,68.62 v88.49,68.3 | v83.1,62.9 83.1,63.54 C21.1 | C21.1 | v83.73,62.9 83.73,63.54 C21.1 | v69.44,67.03 69.44,67.85 C20.1 70.08,67.85 v70.08,67.03 | v73.57,76.24 73.35,76.24 73.25,76.24 DAA_Z.P$1 73.25,76.87 v73.57,76.87 | v86.59,75.92 85.77,75.92 C18.2 85.77,75.28 v86.59,75.28 | v85.95,71.16 85.32,71.16 R31.1 arc-90 v85.95,70.52 | v86.27,68.62 85.45,68.62 85.22,68.39 | 85.22,68.39 C22.1 | v86.27,67.98 85.64,67.98 85.22,68.39 | v77.7,71.16 v78.33,70.52 | v77.7,71.16 v77.7,70.52 U$15.GND@2 | v77.7,71.16 v77.06,70.52 | U$15.GND@2 v77.06,71.16 | U$15.GND@2 v77.7,71.16 | U$15.GND@2 v78.33,71.16 | U$15.GND@2 v78.33,71.79 | U$15.GND@2 v77.06,71.79 | U$15.GND@2 v77.06,72.43 | U$15.GND@2 v78.33,72.43 | v77.7,72.43 v78.33,73.06 | U$15.GND@2 v77.7,73.06 | U$15.GND@2 v77.7,72.43 | v77.7,72.43 v77.06,73.06 | v6.36,58.94 R9.1 | R10.1 v35.25,58.92 | R11.1 63,56.9 v64.21,58.11
  Top 0.305: v16.74,64.81 17,65.07 MOTOR_X.P$4 | U$7.GND@1 18.22,68.19 v18.64,68.62 | v45.63,64.81 45.89,65.07 MOTOR_Y.P$4 | U$12.GND@1 47.11,68.19 v47.54,68.62 | v73.89,64.81 74.15,65.07 MOTOR_Z.P$4 | U$15.GND@1 75.37,68.19 v75.79,68.62 | v15.79,76.87 16.16,76.87 R2.1 16.16,76.24 v15.79,76.24 | v44.68,76.75 45,76.56 R18.1 45.12,76.24 v44.68,76.11 | v73.57,76.87 73.89,76.56 R26.1 74.01,76.24 73.35,76.24 | v62.46,73.7 62.46,74.41 C8.2 62.24,74.11 v61.82,73.7
  Top 0.61: U2.P$2 v13.35,80.02 v13.35,80.66 | v5.82,81.7 6.23,81.28 C28.1 6.45,81.14 v6.45,81.7 | v12.1,85.19 12.1,84.7 C17.1 12.39,84.84 v12.74,85.19 | U3.P$2 v80.97,79.7 v80.97,79.07 | v87.86,78.71 88.15,79 C31.1 88.15,79.06 v88.49,78.71 | v81.38,84.36 81.38,83.93 C30.1 81.67,84.02 v82.02,84.36
  Bottom 0.254: v51.76,16.52 51.45,16.84 C26.2 51.12,17.16 v51.76,17.16 | v51.13,11.76 50.81,12.08 C27.2 | C27.2 | v50.49,11.76 50.49,12.39 C27.2
  Bottom 0.762: 41.6,13.98 R33.1
  Bottom 0.914: v41.6,13.35 41.6,13.98 v40.97,13.98 v41.6,13.35
  other vias: 20.55,71.79 49.44,71.79 77.7,71.79 47,30.17 47,29.54 47,28.9 47,28.27 46.37,28.27 46.37,28.9 46.37,29.54 46.37,30.17 45.73,30.17 45.09,30.17 44.46,30.17 44.78,22.87 45.41,22.87 46.05,22.87 46.05,23.51 45.41,23.51 44.78,23.51 44.14,23.51 43.51,23.51 42.87,23.51 45.73,18.11 46.37,18.11 45.09,18.11 45.09,18.74 45.73,18.74 46.37,18.74 45.73,14.3 45.09,14.3 46.37,14.3 46.37,13.66 45.73,13.66 45.09,13.66
  pour Ground: 1.28,86.37 1.28,87.64 6.36,92.72 87.64,92.72 92.72,87.64 92.72,6.36 87.64,1.28 6.36,1.28 1.28,6.36
  pour Bottom (no thermals): 47.32,27.95 39.7,27.95 39.7,30.49 47.32,30.49
  pour Bottom (no thermals): 41.92,21.92 44.14,21.92 44.46,22.23 46.37,22.23 46.37,23.82 41.92,23.82
  pour Bottom (no thermals): 46.68,13.35 44.78,13.35 44.78,14.62 45.54,15.38 45.54,17.79 44.78,17.79 44.78,19.06 46.68,19.06 46.68,17.79 47,17.47 47,16.9 45.98,16.9 45.98,15.25 46.68,14.62
GPIO_DEBUG_3.4_X  (via drill 0.35)
  Top 0.254: v17.47,59.69 v17.48,59.7 21.91,59.7 25.09,56.51 25.09,54.3 25.73,53.67 MSP_X_DEBUG.7
  Bottom 0.254: U$3.P3.4_GPIO_DEBUG 16.33,65.62 16.03,65.32 16.03,61.09 17.18,59.94 17.22,59.94 v17.47,59.69
GPIO_DEBUG_3.4_Y  (via drill 0.35)
  Top 0.254: v46.37,61.28 v46.37,61.29 49.21,61.29 53.98,56.51 53.98,54.3 54.62,53.67 MSP_Y_DEBUG.7
  Bottom 0.254: v46.37,61.28 46.11,61.53 46.07,61.53 44.92,62.68 44.92,65.32 45.23,65.62 U$10.P3.4_GPIO_DEBUG
GPIO_DEBUG_3.4_Z  (via drill 0.35)
  Top 0.254: v74.62,61.28 v74.63,61.29 77.47,61.29 82.24,56.51 82.24,54.3 82.88,53.67 MSP_Z_DEBUG.7
  Bottom 0.254: v74.62,61.28 74.37,61.53 74.33,61.53 73.18,62.68 73.18,65.32 73.48,65.62 U$13.P3.4_GPIO_DEBUG
GPIO_DEBUG_3.5_X  (via drill 0.35)
  Top 0.254: 26.05,56.21 MSP_X_DEBUG.8 25.86,56.84 25.41,56.84 22.23,60.02 v22.23,60.97 21.28,61.92 18.52,61.92 17.49,62.95 16.2,62.95 16.01,62.95 8.1,62.95 D1.A
  Bottom 0.254: v22.23,60.97 22.23,63.83 20.94,65.12 U$3.P3.5_GPIO_DEBUG
GPIO_DEBUG_3.5_Y  (via drill 0.35)
  Top 0.254: MSP_Y_DEBUG.8 54.94,56.21 48.91,62.24 v46.37,62.24 41.97,62.24 40.31,60.58 39.72,60.58 38.5,61.8 37.77,61.8 37.35,62.22 37.35,62.59 D3.A
  Bottom 0.254: U$10.P3.5_GPIO_DEBUG 46.71,65.12 46.37,64.78 v46.37,62.24
GPIO_DEBUG_3.5_Z  (via drill 0.35)
  Top 0.254: MSP_Z_DEBUG.8 83.2,56.21 77.16,62.24 v74.62,62.24 73.65,63.21 66.68,63.21 66.47,63.42 D4.A
  Bottom 0.254: U$13.P3.5_GPIO_DEBUG 74.97,65.12 74.62,64.78 v74.62,62.24
HN_X
  Top 0.254: 18.64,73.67 18.64,72.75 | 18.64,73.67 18.64,74.02 | R2.2 18.64,76.19 18.64,73.67
  Top 0.305: U$7.W_HN 18.29,71.44 18.64,71.79 18.64,72.75 U$7.V_HN | U$7.U_HN 18.3,74.04 18.33,74.02 18.64,74.02 | R2.2 19.7,76.56 R3.1
HN_Y
  Top 0.254: 47.54,73.99 47.54,72.75 | 47.54,73.99 47.54,74.02 | R18.2 47.54,76.26 47.54,73.99
  Top 0.305: U$12.W_HN 47.19,71.44 47.54,71.79 47.54,72.75 U$12.V_HN | U$12.U_HN 47.19,74.04 47.22,74.02 47.54,74.02 | R18.2 48.59,76.56 R19.1
HN_Z
  Top 0.254: 75.79,73.67 75.79,72.75 | 75.79,73.67 75.79,74.02 | R26.2 75.79,76.22 75.79,73.67
  Top 0.305: U$15.W_HN 75.44,71.44 75.79,71.79 75.79,72.75 U$15.V_HN | U$15.U_HN 75.45,74.04 75.48,74.02 75.79,74.02 | R26.2 77.49,76.56 R27.1
HP_U_X  (1 unrouted)
  Top 0.305: 11.02,65.78 MOTOR_X.P$8 8.17,65.76 7.53,66.39 7.53,69.57 7.21,69.89 4.99,69.89 4.99,73.7 6.26,73.7 7.21,74.65 7.21,76.24 10.39,76.24 10.39,76.23 R4.2 | R4.2 10.07,74.65 | R4.2 10.66,74.69 U$7.U_HP
HP_U_Y  (via drill 0.35)  (1 unrouted)
  Top 0.254: MOTOR_Y.P$8 39.71,65.58 38.43,65.58 38.23,65.38 38.23,62.68 v38.06,62.51
  Top 0.305: 39.92,65.78 MOTOR_Y.P$8 37.06,65.76 36.42,66.39 36.42,69.57 36.11,69.89 33.88,69.89 33.88,73.7 35.15,73.7 36.11,74.65 36.11,76.24 39.28,76.24 39.28,76.23 R20.2 | R20.2 38.96,74.65 | R20.2 39.55,74.69 U$12.U_HP
  Signal 0.254: v38.06,62.51 38.11,62.56
HP_U_Z  (1 unrouted)
  Top 0.254: MOTOR_Z.P$8 68.36,65.76
  Top 0.305: 68.17,65.78 MOTOR_Z.P$8 65.32,65.76 64.68,66.39 64.68,69.57 64.36,69.89 62.14,69.89 62.14,71.77 62.78,72.4 63.19,72.4 63.19,73.35 64.36,74.52 64.36,76.24 67.54,76.24 67.54,76.23 R28.2 | R28.2 67.22,74.65 | R28.2 67.81,74.69 U$15.U_HP
HP_V_X  (1 unrouted)
  Top 0.305: U$7.V_HP 9.76,73.39 R5.2 8.8,72.42 8.8,68.94 11.34,68.94 11.34,66.72 11.66,66.41 11.66,66.08 11.98,65.76 MOTOR_X.P$7
HP_V_Y  (1 unrouted)
  Top 0.305: U$12.V_HP 38.66,73.39 R21.2 37.69,72.42 37.69,68.94 40.23,68.94 40.23,66.72 40.55,66.41 40.55,66.08 40.87,65.76 MOTOR_Y.P$7
HP_V_Z  (1 unrouted)
  Top 0.254: MOTOR_Z.P$7 69.65,65.53
  Top 0.305: U$15.V_HP 66.91,73.39 R29.2 65.95,72.42 65.95,68.94 68.49,68.94 68.49,66.72 68.81,66.41 68.81,66.08 69.13,65.76 MOTOR_Z.P$7
HP_W_X  (1 unrouted)
  Top 0.305: U$7.W_HP 17.61,72.11 16.74,72.11 16.74,72.75 11.66,72.75 10.07,71.16 R6.2 10.39,69.57 13.88,69.57 13.88,66.2 MOTOR_X.P$6
HP_W_Y  (1 unrouted)
  Top 0.254: MOTOR_Y.P$6 42.89,65.55
  Top 0.305: U$12.W_HP 46.5,72.11 45.63,72.11 45.63,72.75 40.55,72.75 38.96,71.16 R22.2 39.28,69.57 42.77,69.57 42.77,66.2 MOTOR_Y.P$6
HP_W_Z  (1 unrouted)
  Top 0.305: U$15.W_HP 74.76,72.11 73.89,72.11 73.89,72.75 68.81,72.75 67.22,71.16 R30.2 67.54,69.57 71.03,69.57 71.03,66.2 MOTOR_Z.P$6
INT_VCC
  Bottom 0.254: C27.1 50.5,14.3 48.27,14.3 47.63,14.93 47.63,15.89 47.57,15.95 U$6.P$7
LDO_3V3_BYP2
  Top 0.61: U2.P$4 8,80.97 C16.2
LDO_5V_BYP
  Top 0.61: U3.P$4 86.38,78.75 C29.2
M_X_RX
  Bottom 0.254: U$3.P2.6_GPIO/PWM 15.6,66.61 16.12,66.09 16.71,66.09 18.36,67.74 23.38,67.74 23.8,67.32 23.8,63.22 25.25,61.76 28.55,61.76 SERIAL_X.2
M_X_TX
  Bottom 0.254: U$3.P2.5_GPIO 15.1,58.59 15.25,58.43 19.78,58.43 20.48,57.74 26.81,57.74 SERIAL_X.1
M_Y_RX
  Bottom 0.254: U$10.P2.6_GPIO/PWM 44.49,66.61 45.01,66.09 45.6,66.09 47.25,67.74 52.27,67.74 52.69,67.32 52.69,63.22 54.14,61.76 57.45,61.76 SERIAL_Y.2
M_Y_TX
  Bottom 0.254: U$10.P2.5_GPIO 43.99,58.59 44.14,58.43 48.68,58.43 49.37,57.74 55.7,57.74 SERIAL_Y.1
M_Z_RX
  Bottom 0.254: U$13.P2.6_GPIO/PWM 72.75,66.61 73.27,66.09 73.86,66.09 75.51,67.74 80.53,67.74 80.95,67.32 80.95,63.22 82.4,61.76 85.7,61.76 SERIAL_Z.2
M_Z_TX
  Bottom 0.254: U$13.P2.5_GPIO 72.25,58.59 72.4,58.43 76.93,58.43 77.63,57.74 83.96,57.74 SERIAL_Z.1
N$2
  Top 0.254: D4.C R11.2
N$3
  Top 0.254: D3.C R10.2
N$4
  Top 0.254: D1.C R9.2
PWM_X  (via drill 0.35)
  Top 0.305: U$7.PWM 23.07,72.09 v22.45,71.47
  Signal 0.254: v22.45,71.47 22.45,70.08 21.6,69.22 20.65,69.22 v20.65,63.12
  Bottom 0.203: MOTOR_X_DEBUG.3 30.59,61.31 23.54,61.31 22.52,60.29 21.95,60.29 21.55,60.69 21.55,62.22 v20.65,63.12
  Bottom 0.254: v20.65,63.12 U$3.P1.7_GPIO/PWM
PWM_Y  (via drill 0.35)
  Top 0.305: U$12.PWM 51.96,72.09 v51.35,71.47
  Signal 0.254: v51.35,71.47 51.35,70.08 50.49,69.22 50.49,64.07 v51.13,63.44
  Bottom 0.203: MOTOR_Y_DEBUG.3 59.48,61.31 56.56,61.31 55.22,59.97 53.81,59.97 51.4,62.38 51.4,63.17 v51.13,63.44
  Bottom 0.254: U$10.P1.7_GPIO/PWM 50.81,63.12 v51.13,63.44
PWM_Z  (via drill 0.35)
  Top 0.305: U$15.PWM 80.22,72.09 v79.6,71.47
  Signal 0.254: v79.6,71.47 79.6,70.08 78.75,69.22 77.8,69.22 v77.8,63.12
  Bottom 0.203: MOTOR_Z_DEBUG.3 87.74,61.31 82.24,61.31 80.43,63.12 v77.8,63.12
  Bottom 0.254: v77.8,63.12 U$13.P1.7_GPIO/PWM
RD_X  (via drill 0.35)
  Top 0.305: U$7.RD 24.33,71.44 24.36,71.47 24.36,72.11 27.22,72.11 R1.1 | R1.1 27,73.06 | R1.1 v26.26,73.06
  Bottom 0.254: 13.1,69.34 U$3.P4.0_GPIO 13.1,72.78 14.3,73.99 25.34,73.99 v26.26,73.06
RD_Y  (via drill 0.35)
  Top 0.305: U$12.RD 53.22,71.44 53.25,71.47 53.25,72.11 56.11,72.11 R17.1 | R17.1 55.89,73.06 | R17.1 v55.16,73.06
  Bottom 0.254: 41.99,69.34 U$10.P4.0_GPIO 41.99,72.78 43.19,73.99 54.23,73.99 v55.16,73.06
RD_Z  (via drill 0.35)
  Top 0.305: U$15.RD 81.48,71.44 81.51,71.47 81.51,72.11 84.37,72.11 R25.1 | R25.1 84.15,73.06 | R25.1 v83.41,73.06
  Bottom 0.254: 70.25,69.34 U$13.P4.0_GPIO 70.25,72.78 71.45,73.99 82.49,73.99 v83.41,73.06
RETRY_X
  Top 0.305: U$7.RETRY 24.26,74.04 25.5,75.28 C1.1
RETRY_Y
  Top 0.305: U$12.RETRY 53.15,74.04 54.39,75.28 C11.1
RETRY_Z
  Top 0.305: U$15.RETRY 81.41,74.04 82.65,75.28 C18.1
RXD_X  (via drill 0.35)
  Top 0.254: MSP_X_DEBUG.4 24.64,47.9 24.64,55.89 v23.82,55.89
  Signal 0.254: v23.82,55.89 23.82,64.33 v22.38,65.77
  Bottom 0.254: v22.38,65.77 21.53,66.62 U$3.P2.1_RXD
RXD_Y  (via drill 0.35)
  Top 0.254: MSP_Y_DEBUG.4 53.53,47.9 53.53,55.89 v53.03,55.89
  Signal 0.254: v53.03,55.89 53.03,64.02 v51.27,65.77
  Bottom 0.254: v51.27,65.77 50.42,66.62 U$10.P2.1_RXD
RXD_Z  (via drill 0.35)
  Top 0.254: MSP_Z_DEBUG.4 81.78,47.9 81.78,55.89 v81.29,55.89
  Signal 0.254: v81.29,55.89 81.29,64.02 v79.53,65.77
  Bottom 0.254: v79.53,65.77 78.68,66.62 U$13.P2.1_RXD
SBWTCK_X  (via drill 0.35)
  Top 0.254: MSP_X_DEBUG.SBWTCK 23.19,41.48 23.19,52.4 v22.55,52.4
  Signal 0.254: v22.55,52.4 21.59,52.4 21.02,51.83 20.28,51.83 19.76,52.35 19.76,53.59 15.11,58.24 15.11,71.4 v14.62,71.89
  Bottom 0.254: v14.62,71.89 16.09,70.41 U$3.SBWTCK
SBWTCK_Y  (via drill 0.35)
  Top 0.254: MSP_Y_DEBUG.SBWTCK 52.08,41.48 52.08,52.4 v51.45,52.4
  Signal 0.254: v51.45,52.4 50.48,52.4 49.91,51.83 49.17,51.83 48.65,52.35 48.65,53.59 44,58.24 44,71.4 v43.51,71.89
  Bottom 0.254: v43.51,71.89 44.99,70.41 U$10.SBWTCK
SBWTCK_Z  (via drill 0.35)
  Top 0.254: MSP_Z_DEBUG.SBWTCK 80.34,41.48 80.34,52.4 v79.7,52.4
  Signal 0.254: v79.7,52.4 78.74,52.4 78.17,51.83 77.43,51.83 76.91,52.35 76.91,53.59 72.26,58.24 72.26,71.4 v71.77,71.89
  Bottom 0.254: v71.77,71.89 73.25,70.41 U$13.SBWTCK
SBWTDIO_X  (via drill 0.35)
  Top 0.254: MSP_X_DEBUG.2 23.68,43.77 23.68,53.67 v23.19,53.67
  Signal 0.254: v15.89,71.89 15.57,71.57 15.57,58.43 20.33,53.67 v23.19,53.67
  Bottom 0.254: v15.89,71.89 16.59,71.18 U$3.SBWTDIO
SBWTDIO_Y  (via drill 0.35)
  Top 0.254: MSP_Y_DEBUG.2 52.58,43.77 52.58,53.67 v52.08,53.67
  Signal 0.254: v44.78,71.89 44.46,71.57 44.46,58.43 49.22,53.67 v52.08,53.67
  Bottom 0.254: v44.78,71.89 45.49,71.18 U$10.SBWTDIO
SBWTDIO_Z  (via drill 0.35)
  Top 0.254: MSP_Z_DEBUG.2 80.83,43.77 80.83,53.67 v80.34,53.67
  Signal 0.254: v73.03,71.89 72.72,71.57 72.72,58.43 77.48,53.67 v80.34,53.67
  Bottom 0.254: v73.03,71.89 73.75,71.18 U$13.SBWTDIO
SW
  pour Bottom (no thermals): 45.03,16.42 43.83,16.42 42.14,18.11 41.92,18.11 41.92,20.46 39.57,20.46 39.38,20.65 39.38,22.87 41.29,22.87 41.29,21.28 44.14,21.28 44.14,17.28 45.03,17.28
SYNC1  (via drill 0.35)
  Top 0.254: v40.97,63.19 45.09,63.19 45.54,63.64 46.34,63.64 46.41,63.72 49.53,63.72 50.83,62.41 51.83,62.41 v52.08,62.66
  Signal 0.254: v40.97,63.19 40.99,63.17 40.31,62.48 39.94,62.48 39.09,61.63 39.09,61.31 27.63,49.86 25.09,49.86 23.58,51.37 18.83,51.37 17.85,52.35 17.85,54.85 11.76,60.95 v11.76,62.24 | v68.59,61.28 66.69,61.29 54.94,61.29 v54.94,60.65
  Bottom 0.254: U$3.P7.2_SYNC1 11.58,63 11.76,62.83 v11.76,62.24 | v40.97,63.19 40.48,63.68 40.48,67.55 40.49,67.56 U$10.P7.2_SYNC1 40.49,69.36 39.89,69.96 39.53,69.96 38.35,71.14 38.35,72.69 40.11,74.45 43.19,74.45 PC104.P$45 | U$13.P7.2_SYNC1 68.75,67.56 68.73,67.55 68.73,61.43 v68.59,61.28 | v54.94,60.65 54.28,61.31 53.95,61.31 52.6,62.66 v52.08,62.66
SYNC2  (via drill 0.35)
  Top 0.254: v40.02,61.29 40.33,61.29 41.78,62.73 45.28,62.73 45.46,62.91 46.04,62.91 46.07,62.95 49.65,62.95 50.65,61.95 53.62,61.95 53.8,61.78 57.22,61.78 57.71,61.29 61.92,61.29 62.88,62.24 v67.95,62.24 | PC104.P$49 44.38,77.53 39.75,77.53 38.97,76.76 v35.59,76.76
  Signal 0.254: v39.38,63.19 39.38,64.31 39.65,64.58 39.65,70.5 35.59,74.56 v35.59,76.76 | v10.73,62.24 11.05,61.92 11.05,61.01 17.4,54.66 17.4,52.16 22.06,47.5 26.69,47.5 27.33,48.13 27.33,48.91 39.71,61.29 v40.02,61.29
  Bottom 0.254: U$3.PJ.3_SYNC2 11.12,68.45 11.12,63.19 10.73,62.8 v10.73,62.24 | U$10.PJ.3_SYNC2 39.99,63.8 v39.38,63.19 39.38,61.92 v40.02,61.29 | U$13.PJ.3_SYNC2 68.25,62.53 v67.95,62.24
TXD_X  (via drill 0.35)
  Top 0.254: MSP_X_DEBUG.3 24.14,45.6 24.14,54.94 v23.51,54.94
  Signal 0.254: v16.41,66.79 16.41,65.48 16.03,65.1 16.03,58.92 19.06,55.89 21.28,55.89 22.23,54.94 v23.51,54.94
  Bottom 0.254: U$3.P2.0_TXD 17.09,67.48 v16.41,66.79
TXD_Y  (via drill 0.35)
  Top 0.254: MSP_Y_DEBUG.3 53.03,45.6 53.03,54.94 v52.4,54.94
  Signal 0.254: v45.3,66.79 45.3,65.48 44.92,65.1 44.92,61.14 51.13,54.94 v52.4,54.94
  Bottom 0.254: U$10.P2.0_TXD 45.99,67.48 v45.3,66.79
TXD_Z  (via drill 0.35)
  Top 0.254: MSP_Z_DEBUG.3 81.29,45.6 81.29,54.94 v80.66,54.94
  Signal 0.254: v73.56,66.79 73.56,65.48 73.18,65.1 73.18,61.14 79.39,54.94 v80.66,54.94
  Bottom 0.254: U$13.P2.0_TXD 74.25,67.48 v73.56,66.79
U_X
  Top 0.305: U$7.U 20.14,68.84 18.5,67.2 MOTOR_X.P$3
U_Y
  Top 0.305: U$12.U 49.03,68.84 47.39,67.2 MOTOR_Y.P$3
U_Z
  Top 0.305: U$15.U 77.29,68.84 75.65,67.2 MOTOR_Z.P$3
V_X
  Top 0.305: U$7.V 20.44,68.19 20,67.75 MOTOR_X.P$2
V_Y
  Top 0.305: U$12.V 49.33,68.19 48.89,67.75 MOTOR_Y.P$2
V_Z
  Top 0.305: U$15.V 77.59,68.19 77.15,67.75 MOTOR_Z.P$2
VBAT  (via drill 0.35)
  Top 0.254: U2.P$3 | 12.16,82.33 C17.2 | U3.P$1
  Top 0.305: PC104.P$69 60.11,77.2 61,77.2 61.68,76.53 C8.1
  Top 0.508: 29.86,55.57 v30.17,55.89 | U2.P$1
  Top 0.61: U2.P$3 10.81,80.97 10.81,79.07 | 10.81,79.07 U2.P$1 | 12.16,82.33 U2.P$3 | 83.51,80.66 U3.P$1 | 83.51,80.66 83.51,78.75 U3.P$3 | U3.P$1 82.16,81.3 C30.2 | 10.81,79.07 v10.81,77.8 v11.44,77.8 | 83.51,80.66 v83.51,82.24 v82.88,82.24 | v30.17,55.89 28.9,54.62 28.9,34.3 30.49,32.71 47.63,32.71 50.49,29.86 v50.49,20.65
  Top 1.524: PC104.P$70 PC104.P$69
  Signal 0.508: v30.17,55.89 30.17,56.52 33.35,59.7 33.35,75.89 32.71,76.53
  Signal 0.61: v10.81,77.8 17.12,77.8 17.28,77.64 31.6,77.64 32.71,76.53 33.83,77.64 57.36,77.64 58.43,78.72 PC104.P$69 | v83.51,82.24 79.93,82.24 79.26,82.91 78.24,82.91 77.98,82.66 60.05,82.66 58.81,81.42 PC104.P$70
  Bottom 0.254: U$6.P$6 48.52,16.45 C26.1
  other vias: 50.49,20.01 50.49,19.38 51.13,19.38 51.13,20.01 51.13,20.65
  pour Bottom (no thermals): 49.54,21.28 51.76,21.28 51.76,18.74 49.54,18.74
  pour Top (no thermals): 49.86,21.28 49.86,18.74 51.76,18.74 51.76,21.28
  pour Bottom (no thermals): 49.54,21.28 47,21.28 47,20.01 47.63,19.38 47.63,16.52 47.95,16.52 47.95,14.62 49.54,14.62
VCP_X
  Top 0.305: C3.2 12.8,71.16 16.74,71.16 17.1,70.79 U$7.VCP
VCP_Y
  Top 0.305: C13.2 41.69,71.16 45.63,71.16 46,70.79 U$12.VCP
VCP_Z
  Top 0.305: C20.2 69.95,71.16 73.89,71.16 74.25,70.79 U$15.VCP
VD
  pour Bottom (no thermals): 49.54,21.92 47,21.92 47,24.33 41.22,24.33 41.22,23.51 39.63,23.51 39.63,24.9 46.49,24.9 47.95,26.36 47.95,27.32 49.54,27.32
VINT_X  (via drill 0.35)
  Top 0.152: 10.05,63.92 10.05,63.88 10.07,63.86
  Top 0.254: C4.2 25.44,65.76 25.07,66.12 23.77,66.12 23.6,65.95 | v10.05,65.03 10.05,63.92
  Top 0.305: 10.07,67.98 R6.1 | 10.07,67.98 8.17,67.98 8.04,68.11 8.04,71.05 7.74,71.35 7.02,71.35 6.9,71.47 6.9,71.48 R5.1 6.9,73.38 R4.1 8.54,73.72 v8.58,73.67 | MOTOR_X.P$5 15.47,65.73 15.47,63.86 | 10.07,63.86 15.47,63.86 | v10.05,66.65 10.07,66.67 10.07,67.98 | 15.47,63.86 21.5,63.86 23.6,65.95 | 26.26,69.57 26.58,69.25 26.58,66.08 26.26,66.08 C4.2 | U$7.VINT 24.42,70.14 24.68,69.89 24.68,69.57 26.26,69.57 | 26.26,69.57 29.63,69.57 29.63,72.5 | R1.2 29.63,72.5 | 29.63,72.5 29.87,72.74 CMTMOD_X.P$3 30.77,73.44 R8.1 31.15,74.12 32.11,75.08 32.11,76.17 30.9,77.38 23.83,77.38 23.08,76.63 R3.2 | DAA_X.P$3 11.44,76.46 v11.44,75.43
  Signal 0.305: v10.05,65.03 v10.05,66.65 | v11.44,75.43 9.68,73.67 v8.58,73.67
VINT_Y  (via drill 0.35)
  Top 0.254: 53.57,67.03 50.71,64.17 46.22,64.17 46.15,64.1 44.51,64.1 44.36,64.24 44.36,64.17 | 38.96,64.17 38.96,64.85 v38.94,64.87
  Top 0.305: 38.96,67.98 R22.1 | 38.96,67.98 37.06,67.98 36.93,68.11 36.93,71.05 36.63,71.35 35.91,71.35 35.79,71.47 35.79,71.48 R21.1 35.79,73.38 R20.1 37.43,73.72 v37.48,73.67 | MOTOR_Y.P$5 44.36,65.73 44.36,64.17 38.96,64.17 | v38.94,66.65 38.96,66.67 38.96,67.98 | 55.16,67.03 55.47,67.03 55.47,69.25 55.16,69.57 | 55.16,67.03 53.57,67.03 | U$12.VINT 53.31,70.14 53.57,69.89 53.57,69.57 55.16,69.57 | C14.2 55.16,67.03 | 55.16,69.57 58.52,69.57 58.52,71.67 58.11,72.08 58.11,72.91 R17.2 | 58.01,73.38 R17.2 | R17.2 CMTMOD_Y.P$3 60.05,73.5 R24.1 60.05,74.44 61,75.39 61,76.49 60.79,76.7 59.53,76.7 58.86,77.37 58.85,77.37 58.84,77.38 52.72,77.38 51.97,76.63 R19.2 | DAA_Y.P$3 40.33,76.46 v40.33,75.43
  Signal 0.305: v38.94,64.87 v38.94,66.65 | v40.33,75.43 38.58,73.67 v37.48,73.67
VINT_Z  (via drill 0.35)
  Top 0.254: v67.2,63.92 67.2,63.88 67.22,63.86
  Top 0.305: 67.22,67.98 R30.1 | 67.22,67.98 65.32,67.98 65.19,68.11 65.19,71.05 64.89,71.35 64.17,71.35 64.05,71.47 64.05,71.48 R29.1 64.05,73.38 R28.1 65.69,73.72 v65.73,73.67 | MOTOR_Z.P$5 72.62,65.73 72.62,63.86 | 67.22,63.86 72.62,63.86 | v67.2,66.65 67.22,66.67 67.22,67.98 | 72.62,63.86 78.65,63.86 81.83,67.03 83.41,67.03 | 83.41,67.03 83.73,67.03 83.73,69.25 83.41,69.57 | U$15.VINT 81.57,70.14 81.83,69.89 81.83,69.57 83.41,69.57 | C21.2 83.41,67.03 | 83.41,69.57 86.91,69.57 86.91,72.38 | 86.27,73.38 R25.2 86.91,72.38 | 86.91,72.38 87.28,72.75 CMTMOD_Z.P$3 88.18,73.7 R32.1 88.3,74.12 89.26,75.08 89.26,76.17 88.05,77.38 80.98,77.38 80.22,76.63 R27.2 | DAA_Z.P$3 68.59,76.01 v68.59,75.43
  Signal 0.305: v67.2,63.92 v67.2,66.65 | v68.59,75.43 66.83,73.67 v65.73,73.67
VM  (via drill 0.35)
  Top 0.254: 23.41,67.03 v23.09,67.03 v22.45,67.03 | v51.98,67.03 52.3,67.03 | v80.24,67.03 80.56,67.03
  Top 0.305: U$7.VM 23.99,69.49 C5.2 24.68,68.3 23.41,67.03 | U$12.VM 52.88,69.49 C15.2 53.57,68.3 52.3,67.03 | U$15.VM 81.14,69.49 C22.2 81.83,68.3 80.56,67.03
  Top 0.508: v24.78,65.42 25.06,65.13 25.06,62.39 27,60.45 27,57.68 27.89,56.79 v27.89,44.14 27.89,33.73 29.86,31.76 38.11,31.76 v38.11,28.27 | v24.78,66.83 24.78,67.89 C5.2
  Signal 0.508: v24.78,65.42 v24.78,66.83 | v51.98,67.03 51.98,66.25 53.87,64.36 53.87,53.64 53.03,52.8 53.03,50.49 | 53.03,50.49 46.68,44.14 v27.89,44.14 | v80.24,67.03 v79.6,67.03 79.6,66.88 82.12,64.36 82.12,49.98 80.42,48.27 56.52,48.27 56.35,48.45 56.35,49.09 55.53,49.91 54.88,49.91 54.29,50.49 53.03,50.49
  Bottom 0.254: R16.2 38.75,17.47 C34.1 38.75,25.09 40.2,26.55 C36.1
  Bottom 0.508: v38.11,28.9 v38.11,28.27
  Bottom 1.016: v38.11,28.9 38.11,27 38.56,26.55 42.11,26.55 42.24,26.68 42.74,26.68 C33.1 | 39.06,26.55 38.75,26.87 v38.75,28.9
  other vias: 38.75,28.27 38.75,27.63 38.11,27.63
  pour Top (no thermals): 37.48,29.54 39.38,29.54 39.38,27.32 37.48,27.32
  pour Bottom (no thermals): 37.48,29.54 39.38,29.54 39.38,27.32 37.48,27.32
  pour Bottom (no thermals): 47.32,27.32 47.32,26.68 46.05,25.41 39.7,25.41 39.7,27.32
W_X
  Top 0.305: U$7.W 16.96,68.84 16.74,68.62 16.74,67.67 17.69,66.71 17.69,65.12 18.01,64.81 21.18,64.81 21.5,65.12 MOTOR_X.P$1
W_Y
  Top 0.305: U$12.W 45.86,68.84 45.63,68.62 45.63,67.67 46.58,66.71 46.58,65.12 46.9,64.81 50.08,64.81 50.39,65.12 MOTOR_Y.P$1
W_Z
  Top 0.305: U$15.W 74.11,68.84 73.89,68.62 73.89,67.67 74.84,66.71 74.84,65.12 75.16,64.81 78.33,64.81 78.65,65.12 MOTOR_Z.P$1